# Altium schematic sheet SensorPH.SchDoc
size A4
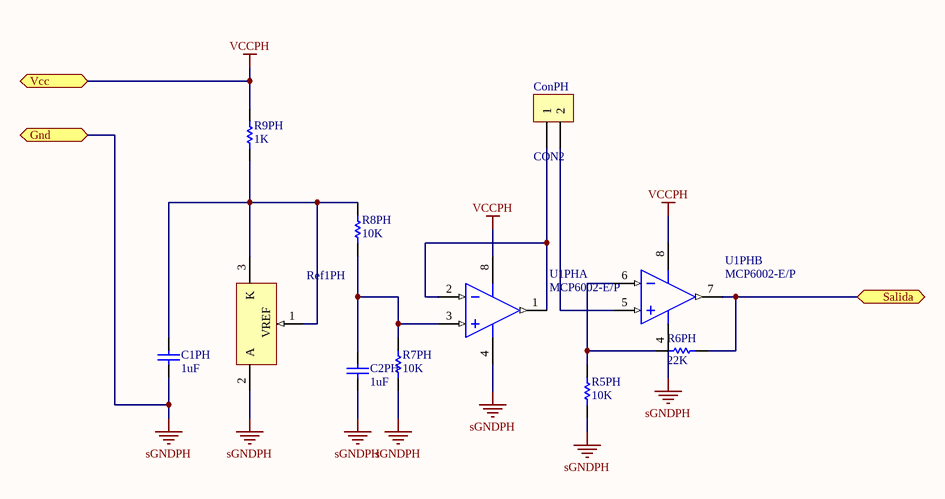
[diagram p0: SensorPH.SchDoc]

## Parts
C1PH  1uF  [CAPPOL100]
C2PH  1uF  [CAPPOL100]
ConPH  CON2  [BORNERA2 - T]
R5PH  10K  [RES300]
R6PH  22K  [RES300]
R7PH  10K  [RES300]
R8PH  10K  [RES300]
R9PH  1K  [RES300]
Ref1PH  TL431ACLP  [LP03]  (value not drawn)
U1PH  MCP6002-E/P  [DIP8B]  (parts A,B of 2)

## Ports
Gnd, Salida, Vcc

## Nets
sGNDPH: C1PH.1 C2PH.1 R5PH.1 R7PH.1 Ref1PH.2(A) U1PH.4(VSS) ; port Gnd
VCCPH: R9PH.2 U1PH.8(VDD) ; port Vcc
Salida: R6PH.1 U1PH.7(VOUTB) ; port Salida
NetC1PH_2: C1PH.2 R8PH.2 R9PH.1 Ref1PH.1(VREF) Ref1PH.3(K)
NetC2PH_2: C2PH.2 R7PH.2 R8PH.1 U1PH.3(VINA+)
NetConPH_1: ConPH.1 U1PH.1(VOUTA) U1PH.2(VINA-)
NetConPH_2: ConPH.2 U1PH.5(VINB+)
NetR5PH_2: R5PH.2 R6PH.2 U1PH.6(VINB-)

## Library data of the parts
C1PH C2PH = CAP: Capacitor
ConPH = CON2: Conector 2
R5PH R6PH R7PH R8PH R9PH = RES: Resistencia
Ref1PH = TL431ACLP: Adjustable Precision Shunt Regulator; Published: 15-Apr-2002; LatestRevisionDate: 06-Jun-2005; LatestRevisionNote: Sch pins 1 & 3 swapped; DatasheetVersion: Oct-2000; PackageVersion: Nov-2001; PackageReference: LP03; Publisher: Altium Limited; PackageDescription: TO, Flat Index; 3 In-Line, Axial Leads; Body Dia. 4.8mm; Leads 0.56 x 0.41 mm (max); Code_JEDEC: TO-226-AA; ComponentLink1Description: Manufacturer Link; ComponentLink1URL: http://www.ti.com/; ComponentLink2Description: Datasheet; ComponentLink2URL: http://www-s.ti.com/sc/ds/tl431a.pdf
U1PH = MCP6002-E/P: 1 MHz, Low-Power Operational Amplifier, 8-Pin PDIP, Extended Temperature; Published: 29-Jan-2009; LatestRevisionDate: 02-Dec-2009; LatestRevisionNote: Updated to datasheet revision J, Nov-2009; DatasheetVersion: revJ, Nov-2009; PackageVersion: revBB, Aug-2009; PackageReference: PDIP300-P8; Publisher: Altium Limited; PackageDescription: 8-Lead Plastic Dual In-Line (P) - 300 mil Body [PDIP]; Supplier 1: Digi-Key; Supplier Part Number 1: MCP6002-E/P-ND; Supplier 2: Farnell; Supplier Part Number 2: 1332117; Code_JEDEC: MS-001; ComponentLink1Description: Datasheet; ComponentLink1URL: http://ww1.microchip.com/downloads/en/DeviceDoc/21733j.pdf; ComponentLink2Description: Packaging Specification; ComponentLink2URL: http://www.microchip.com/stellent/groups/techpub_sg/documents/packagingspec/en012702.pdf; ComponentLink3Description: Microchip.com Home; ComponentLink3URL: http://www.microchip.com/